# Altium schematic sheet ShutdownDPDT-S02-V00-Relay.SchDoc
size A4; SheetNumber: 3; SheetTotal: 4
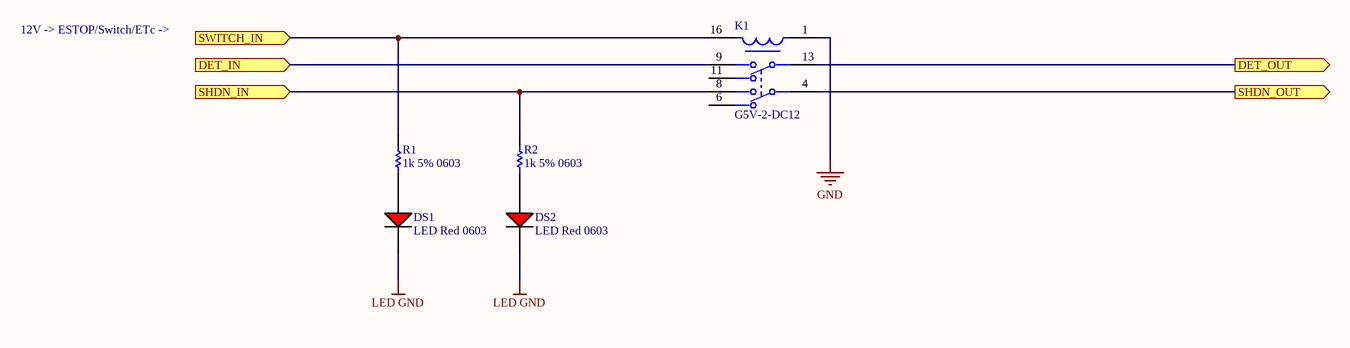
[diagram p0: ShutdownDPDT-S02-V00-Relay.SchDoc]

## Parts
DS1  LED Red 0603  [LED RED 0603]
DS2  LED Red 0603  [LED RED 0603]
K1  G5V-2-DC12  [FP-G5V-2-DC12-MFG]
R1  1k 5% 0603  [Res_ThinFilm_0603]
R2  1k 5% 0603  [Res_ThinFilm_0603]

## Ports
DET_IN (in), DET_OUT (out), SHDN_IN (in), SHDN_OUT (out), SWITCH_IN (in)

## Nets
GND: K1.1
LED GND: DS1.2(C) DS2.2(C)
DET_IN: K1.9 ; port DET_IN
DET_OUT: K1.13 ; port DET_OUT
SHDN_IN: K1.8 R2.2 ; port SHDN_IN
SHDN_OUT: K1.4 ; port SHDN_OUT
SWITCH_IN: K1.16 R1.2 ; port SWITCH_IN
NetDS1_1: DS1.1(A) R1.1
NetDS2_1: DS2.1(A) R2.1

Not connected (* = marked no-connect by the designer): K1 6 11

## Notes on the sheet
- 12V -> ESTOP/Switch/ETc ->

## Library data of the parts
K1 = CMP-08823-000082-1: RELAY GEN PURPOSE DPDT 2A 12VDC; Manufacturer Series: G5V-2; Relay Action: MOMENTARY; Coil Voltage (DC): 12V; Power Consumption: 500mW; Operate Time: 7ms; Reference Standard: UL; Relay Type: General Purpose; Voltage Rating (DC): 125V; Coil Current: 41.7mA; Coil Type: Non-Latching; Release Time: 3ms; Coil Resistance: 288R; Throw Configuration: DPDT; Depth: 10.1mm; Relay Function: DPDT; Mount: Through Hole; Current Rating: 2A; Number of Pins: 8; Weight: 5g; Coil Power: 500mW; Radiation Hardening: No; Case/Package: DIP; Series: G5V-2; Height: 11.5mm; Width: 10.1mm; Voltage Rating (AC): 125V; Approvals: UL; Contact Material: Gold; Max Current Rating: 2A; Max Operating Temperature: 65°C; Min Operating Temperature: -25°C; Contact Current Rating: 2A; Termination: PC Pin; Max Voltage Rating (DC): 125V; Lead Free: Lead Free; Max Voltage Rating (AC): 125V; Power Rating: 500mW; Type: Electromechanical; Packaging: Rail/Tube; Package Quantity: 25; Length: 20.5mm
R1 R2 = 1k 5% 0603: Resistor, SMD, 1k, 0.1W, 5%, 0603